# EAGLE design 13thISE.ver11 (EAGLE 9.6.2)
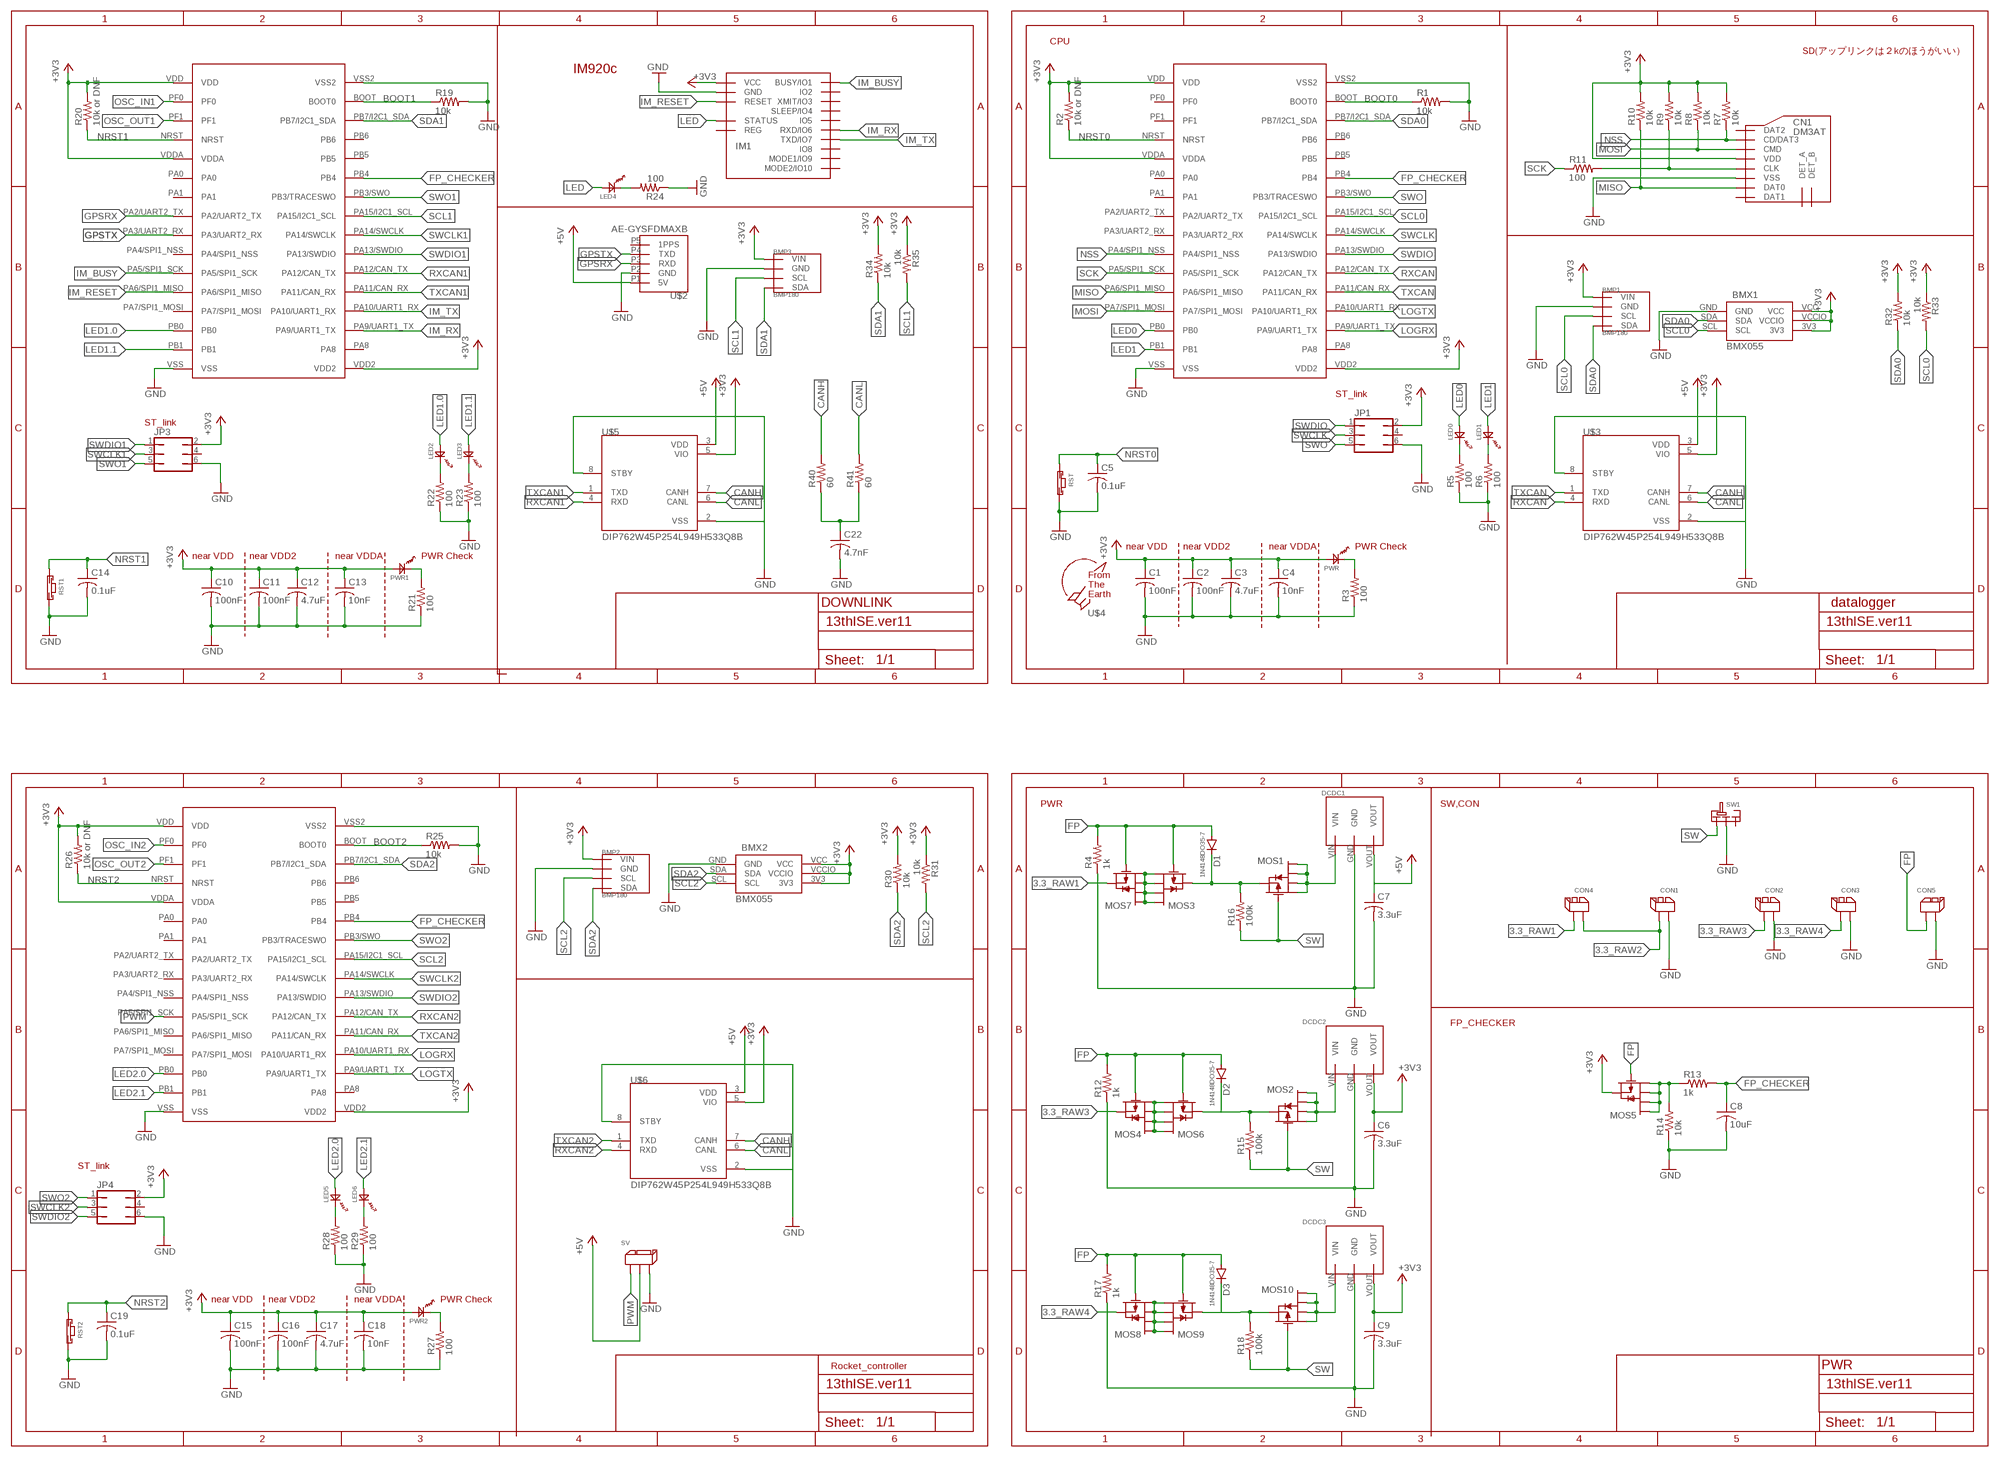
[diagram p0: schematic, sheet 1]

## Parts
BMP1  BMP180  [GY-68]
BMP2  BMP180  [GY-68]
BMP3  BMP180  [GY-68]
BMX1  BMX055  [BMX055]
BMX2  BMX055  [BMX055]
C1  100nF  C-USC1608  [C1608]
C2  100nF  C-USC1608  [C1608]
C3  4.7uF  C-USC1608  [C1608]
C4  10nF  C-USC1608  [C1608]
C5  0.1uF  C-USC1608  [C1608]
C6  3.3uF  C-USC0603  [C0603]
C7  3.3uF  C-USC0603  [C0603]
C8  10uF  C-USC0603  [C0603]
C9  3.3uF  C-USC0603  [C0603]
C10  100nF  C-USC1608  [C1608]
C11  100nF  C-USC1608  [C1608]
C12  4.7uF  C-USC1608  [C1608]
C13  10nF  C-USC1608  [C1608]
C14  0.1uF  C-USC1608  [C1608]
C15  100nF  C-USC1608  [C1608]
C16  100nF  C-USC1608  [C1608]
C17  4.7uF  C-USC1608  [C1608]
C18  10nF  C-USC1608  [C1608]
C19  0.1uF  C-USC1608  [C1608]
C22  4.7nF  C-USC0603  [C0603]
CN1  DM3AT  [DM3AT]
CON1  2PIN  [2PIN]
CON2  2PIN  [2PIN]
CON3  2PIN  [2PIN]
CON4  2PIN  [2PIN]
CON5  2PIN  [2PIN]
D1  1N4148DO35-7  [DO35-7]
D2  1N4148DO35-7  [DO35-7]
D3  1N4148DO35-7  [DO35-7]
DCDC1  5V1A_M78AR05-1  [5V1A_M78AR05-1]
DCDC2  3.3V1A_M78AR033-1  [3.3V1A_M78AR033-1]
DCDC3  3.3V1A_M78AR033-1  [3.3V1A_M78AR033-1]
IM1  IM920_IM920C  [IM920_IM920C]
JP1  JP3Q  [JP3Q]
JP3  JP3Q  [JP3Q]
JP4  JP3Q  [JP3Q]
LED0  OSXX1608C1A  [OSXX1608C1A]
LED1  OSXX1608C1A  [OSXX1608C1A]
LED2  OSXX1608C1A  [OSXX1608C1A]
LED3  OSXX1608C1A  [OSXX1608C1A]
LED4  OSXX1608C1A  [OSXX1608C1A]
LED5  OSXX1608C1A  [OSXX1608C1A]
LED6  OSXX1608C1A  [OSXX1608C1A]
MOS1  PCH_SSM6J808R  [SSM6J808R]
MOS2  PCH_SSM6J808R  [SSM6J808R]
MOS3  PCH_SSM6J808R  [SSM6J808R]
MOS4  PCH_SSM6J808R  [SSM6J808R]
MOS5  PCH_SSM6J808R  [SSM6J808R]
MOS6  PCH_SSM6J808R  [SSM6J808R]
MOS7  PCH_SSM6J808R  [SSM6J808R]
MOS8  PCH_SSM6J808R  [SSM6J808R]
MOS9  PCH_SSM6J808R  [SSM6J808R]
MOS10  PCH_SSM6J808R  [SSM6J808R]
PWR  OSXX1608C1A  [OSXX1608C1A]
PWR1  OSXX1608C1A  [OSXX1608C1A]
PWR2  OSXX1608C1A  [OSXX1608C1A]
R1  10k  R-US_R0603  [R0603]
R2  10k or DNF  R-US_R0603  [R0603]
R3  100  R-US_R0603  [R0603]
R4  1k  R-US_R0603  [R0603]
R5  100  R-US_R0603  [R0603]
R6  100  R-US_R0603  [R0603]
R7  10k  R-US_R0603  [R0603]
R8  10k  R-US_R0603  [R0603]
R9  10k  R-US_R0603  [R0603]
R10  10k  R-US_R0603  [R0603]
R11  100  R-US_R0603  [R0603]
R12  1k  R-US_R0603  [R0603]
R13  1k  R-US_R0603  [R0603]
R14  10k  R-US_R0603  [R0603]
R15  100k  R-US_R0603  [R0603]
R16  100k  R-US_R0603  [R0603]
R17  1k  R-US_R0603  [R0603]
R18  100k  R-US_R0603  [R0603]
R19  10k  R-US_R0603  [R0603]
R20  10k or DNF  R-US_R0603  [R0603]
R21  100  R-US_R0603  [R0603]
R22  100  R-US_R0603  [R0603]
R23  100  R-US_R0603  [R0603]
R24  100  R-US_R0603  [R0603]
R25  10k  R-US_R0603  [R0603]
R26  10k or DNF  R-US_R0603  [R0603]
R27  100  R-US_R0603  [R0603]
R28  100  R-US_R0603  [R0603]
R29  100  R-US_R0603  [R0603]
R30  10k  R-US_R0603  [R0603]
R31  10k  R-US_R0603  [R0603]
R32  10k  R-US_R0603  [R0603]
R33  10k  R-US_R0603  [R0603]
R34  10k  R-US_R0603  [R0603]
R35  10k  R-US_R0603  [R0603]
R40  60  R-US_R0603  [R0603]
R41  60  R-US_R0603  [R0603]
RST  TVAF06-A020B-R  [TVAF06-A020B-R]
RST1  TVAF06-A020B-R  [TVAF06-A020B-R]
RST2  TVAF06-A020B-R  [TVAF06-A020B-R]
STM0  STM32F303K8  [STM32F303K8]
STM1  STM32F303K8  [STM32F303K8]
SV  3PIN  [3PIN]
SW1  SRIDE_SWITCH  [SRIDE_SWITCH]
U$1  STM32F303K8  [STM32F303K8]
U$2  AE-GYSFDMAXB  [AE-GYSFDMAXB]
U$3  DIP762W45P254L949H533Q8B  [DIP762W45P254L949H533Q8B]
U$4  F.T.E.LOGO  [LOGO]
U$5  DIP762W45P254L949H533Q8B  [DIP762W45P254L949H533Q8B]
U$6  DIP762W45P254L949H533Q8B  [DIP762W45P254L949H533Q8B]

## Nets
3.3_RAW1: CON4.P$2 MOS7.4
3.3_RAW2: CON1.P$2 CON4.P$1
3.3_RAW3: CON2.P$2 MOS4.4
3.3_RAW4: CON3.P$2 MOS8.4
+3V3: BMP1.P1(VIN) BMP2.P1(VIN) BMP3.P1(VIN) BMX1.3V3 BMX1.VCC BMX1.VCCIO BMX2.3V3 BMX2.VCC BMX2.VCCIO C1.1 C2.1 C3.1 C4.1 C6.1 C9.1 C10.1 C11.1 C12.1 C13.1 C15.1 C16.1 C17.1 C18.1 CN1.VDD DCDC2.VOUT DCDC3.VOUT IM1.$P17(VCC) JP1.2 JP3.2 JP4.2 MOS5.4 PWR1.AN PWR2.AN PWR.AN R2.2 R7.2 R8.2 R9.2 R10.2 R20.2 R26.2 R30.2 R31.1 R32.2 R33.1 R34.2 R35.1 STM0.VDD STM0.VDD2 STM0.VDDA STM1.VDD STM1.VDD2 STM1.VDDA U$1.VDD U$1.VDD2 U$1.VDDA U$3.5(VIO) U$5.5(VIO) U$6.5(VIO)
+5V: C7.1 DCDC1.VOUT SV.P$2 U$2.P1(5V) U$3.3(VDD) U$5.3(VDD) U$6.3(VDD)
+5V1: DCDC1.VIN MOS1.1 MOS1.2 MOS1.5 MOS1.6
BOOT0: R1.1 STM0.BOOT(BOOT0)
BOOT1: R19.1 STM1.BOOT(BOOT0)
BOOT2: R25.1 U$1.BOOT(BOOT0)
CANH: R40.2 U$3.7(CANH) U$5.7(CANH) U$6.7(CANH)
CANL: R41.2 U$3.6(CANL) U$5.6(CANL) U$6.6(CANL)
FP: CON5.P$1 D1.A D2.A D3.A MOS3.3 MOS4.3 MOS5.3 MOS6.3 MOS7.3 MOS8.3 MOS9.3 R4.2 R12.2 R17.2
FP_CHECKER: C8.1 R13.2 STM0.PB4 STM1.PB4 U$1.PB4
GND: BMP1.P2(GND) BMP2.P2(GND) BMP3.P2(GND) BMX1.GND BMX2.GND C1.2 C2.2 C3.2 C4.2 C5.2 C6.2 C7.2 C8.2 C9.2 C10.2 C11.2 C12.2 C13.2 C14.2 C15.2 C16.2 C17.2 C18.2 C19.2 C22.2 CN1.VSS CON1.P$1 CON2.P$1 CON3.P$1 CON5.P$2 DCDC1.GND DCDC2.GND DCDC3.GND IM1.$P18(GND) JP1.6 JP3.6 JP4.6 R1.2 R3.1 R4.1 R5.1 R6.1 R12.1 R14.1 R17.1 R19.2 R21.1 R22.1 R23.1 R24.1 R25.2 R27.1 R28.1 R29.1 RST1.P$2 RST2.P$2 RST.P$2 STM0.VSS STM0.VSS2 STM1.VSS STM1.VSS2 SV.P$3 SW1.LR U$1.VSS U$1.VSS2 U$2.P2(GND) U$3.2(VSS) U$3.8(STBY) U$5.2(VSS) U$5.8(STBY) U$6.2(VSS) U$6.8(STBY)
GPSRX: STM1.PA2/UART2_TX U$2.P3(RXD)
GPSTX: STM1.PA3/UART2_RX U$2.P4(TXD)
IM_BUSY [im]: IM1.$P1(BUSY/IO1) STM1.PA5/SPI1_SCK
IM_RESET [im]: IM1.$P19(RESET) STM1.PA6/SPI1_MISO
IM_RX [im]: IM1.$P6(RXD/IO6) STM1.PA9/UART1_TX
IM_TX [im]: IM1.$P7(TXD/IO7) STM1.PA10/UART1_RX
LED [im]: IM1.$P15(STATUS) LED4.AN
LED0: LED0.AN STM0.PB0
LED1: LED1.AN STM0.PB1
LED1.0: LED2.AN STM1.PB0
LED1.1: LED3.AN STM1.PB1
LED2.0: LED5.AN U$1.PB0
LED2.1: LED6.AN U$1.PB1
LOGRX: STM0.PA9/UART1_TX U$1.PA10/UART1_RX
LOGTX: STM0.PA10/UART1_RX U$1.PA9/UART1_TX
MISO: CN1.DAT0 R10.1 STM0.PA6/SPI1_MISO
MOSI: CN1.CMD R8.1 STM0.PA7/SPI1_MOSI
N$1: PWR.CT R3.2
N$2: LED0.CT R5.2
N$3: D1.C MOS1.4 MOS3.4 R16.2
N$4: LED1.CT R6.2
N$5: D2.C MOS2.4 MOS6.4 R15.2
N$6: MOS4.1 MOS4.2 MOS4.5 MOS4.6 MOS6.1 MOS6.2 MOS6.5 MOS6.6
N$7: CN1.CLK R9.1 R11.2
N$8: DCDC2.VIN MOS2.1 MOS2.2 MOS2.5 MOS2.6
N$9: D3.C MOS9.4 MOS10.4 R18.2
N$10: MOS8.1 MOS8.2 MOS8.5 MOS8.6 MOS9.1 MOS9.2 MOS9.5 MOS9.6
N$11: PWR2.CT R27.2
N$12: MOS3.1 MOS3.2 MOS3.5 MOS3.6 MOS7.1 MOS7.2 MOS7.5 MOS7.6
N$13: DCDC3.VIN MOS10.1 MOS10.2 MOS10.5 MOS10.6
N$14: MOS5.1 MOS5.2 MOS5.5 MOS5.6 R13.1 R14.2
N$15: PWR1.CT R21.2
N$16: LED2.CT R22.2
N$17: LED3.CT R23.2
N$18: LED4.CT R24.2
N$19: LED5.CT R28.2
N$20: LED6.CT R29.2
N$22: C22.1 R40.1 R41.1
NRST0: C5.1 R2.1 RST.P$1 STM0.NRST
NRST1: C14.1 R20.1 RST1.P$1 STM1.NRST
NRST2: C19.1 R26.1 RST2.P$1 U$1.NRST
NSS: CN1.CD/DAT3 R7.1 STM0.PA4/SPI1_NSS
OSC_IN1: STM1.PF0
OSC_IN2: U$1.PF0
OSC_OUT1: STM1.PF1
OSC_OUT2: U$1.PF1
PWM: SV.P$1 U$1.PA5/SPI1_SCK
RXCAN: STM0.PA12/CAN_TX U$3.4(RXD)
RXCAN1: STM1.PA12/CAN_TX U$5.4(RXD)
RXCAN2: U$1.PA12/CAN_TX U$6.4(RXD)
SCK: R11.1 STM0.PA5/SPI1_SCK
SCL0: BMP1.P3(SCL) BMX1.SCL R33.2 STM0.PA15/I2C1_SCL
SCL1: BMP3.P3(SCL) R35.2 STM1.PA15/I2C1_SCL
SCL2: BMP2.P3(SCL) BMX2.SCL R31.2 U$1.PA15/I2C1_SCL
SDA0: BMP1.P4(SDA) BMX1.SDA R32.1 STM0.PB7/I2C1_SDA
SDA1: BMP3.P4(SDA) R34.1 STM1.PB7/I2C1_SDA
SDA2: BMP2.P4(SDA) BMX2.SDA R30.1 U$1.PB7/I2C1_SDA
SW: MOS1.3 MOS2.3 MOS10.3 R15.1 R16.1 R18.1 SW1.L
SWCLK: JP1.3 STM0.PA14/SWCLK
SWCLK1: JP3.3 STM1.PA14/SWCLK
SWCLK2: JP4.3 U$1.PA14/SWCLK
SWDIO: JP1.1 STM0.PA13/SWDIO
SWDIO1: JP3.1 STM1.PA13/SWDIO
SWDIO2: JP4.5 U$1.PA13/SWDIO
SWO: JP1.5 STM0.PB3/SWO(PB3/TRACESWO)
SWO1: JP3.5 STM1.PB3/SWO(PB3/TRACESWO)
SWO2: JP4.1 U$1.PB3/SWO(PB3/TRACESWO)
TXCAN: STM0.PA11/CAN_RX U$3.1(TXD)
TXCAN1: STM1.PA11/CAN_RX U$5.1(TXD)
TXCAN2: U$1.PA11/CAN_RX U$6.1(TXD)
Unconnected: CN1.DAT1 CN1.DAT2 CN1.DET_A CN1.DET_B IM1.$P2(IO2) IM1.$P3(XMIT/IO3) IM1.$P4(SLEEP/IO4) IM1.$P5(IO5) IM1.$P8(IO8) IM1.$P9(MODE1/IO9) IM1.$P10(MODE2/IO10) IM1.$P16(REG) JP1.4 JP3.4 JP4.4 STM0.PA0 STM0.PA1 STM0.PA2/UART2_TX STM0.PA3/UART2_RX STM0.PA8 STM0.PB5 STM0.PB6 STM0.PF0 STM0.PF1 STM1.PA0 STM1.PA1 STM1.PA4/SPI1_NSS STM1.PA7/SPI1_MOSI STM1.PA8 STM1.PB5 STM1.PB6 SW1.R U$1.PA0 U$1.PA1 U$1.PA2/UART2_TX U$1.PA3/UART2_RX U$1.PA4/SPI1_NSS U$1.PA6/SPI1_MISO U$1.PA7/SPI1_MOSI U$1.PA8 U$1.PB5 U$1.PB6 U$2.P5(1PPS)

## Notes on the sheet
- CPU
- SD(アップリンクは２kのほうがいい）
- IM920c
- ST_link
- ST_link
- near VDD | near VDD2 | near VDDA | PWR Check
- near VDD | near VDD2 | near VDDA | PWR Check
- DOWNLINK | datalogger
- PWR | SW,CON
- FP_CHECKER
- ST_link
- near VDD | near VDD2 | near VDDA | PWR Check
- Rocket_controller | PWR

## Library data of the parts
BMP1-BMP3 = BMP180:BMP180
BMX1 BMX2 = BMX055:BMX055
C1-C19 C22 = rcl:C-US: CAPACITOR, American symbol; SPICEPREFIX: C
CN1 = microSD:DM3AT
CON1-CON5 = XR Connector:2PIN
D1-D3 = diode:1N4148: DIODE high speed (Philips)
DCDC1 = DC-DC:5V1A_M78AR05-1
DCDC2 DCDC3 = DC-DC:3.3V1A_M78AR033-1
IM1 = CANSAT12th:IM920_IM920C
JP1 JP3 JP4 = jumper:JP3Q: JUMPER
LED0 LED1-LED6 PWR PWR1 PWR2 = Chip LED:OSXX1608C1A
MOS1-MOS10 = Chip MOSFET:PCH_SSM6J808R
R1-R35 R40 R41 = rcl:R-US_: RESISTOR, American symbol; SPICEPREFIX: R
RST RST1 RST2 = Tact switch:TVAF06-A020B-R
STM0 STM1 U$1 = STM32F303K8:STM32F303K8
SV = XR Connector:3PIN
SW1 = Sride Switch:SRIDE_SWITCH
U$2 = AE-GYSFDMAXB:AE-GYSFDMAXB
U$3 U$5 U$6 = MCP2562-E_P:DIP762W45P254L949H533Q8B
U$4 = logo:F.T.E.LOGO

## Net classes
0 default: width 0.406 mm

## Board
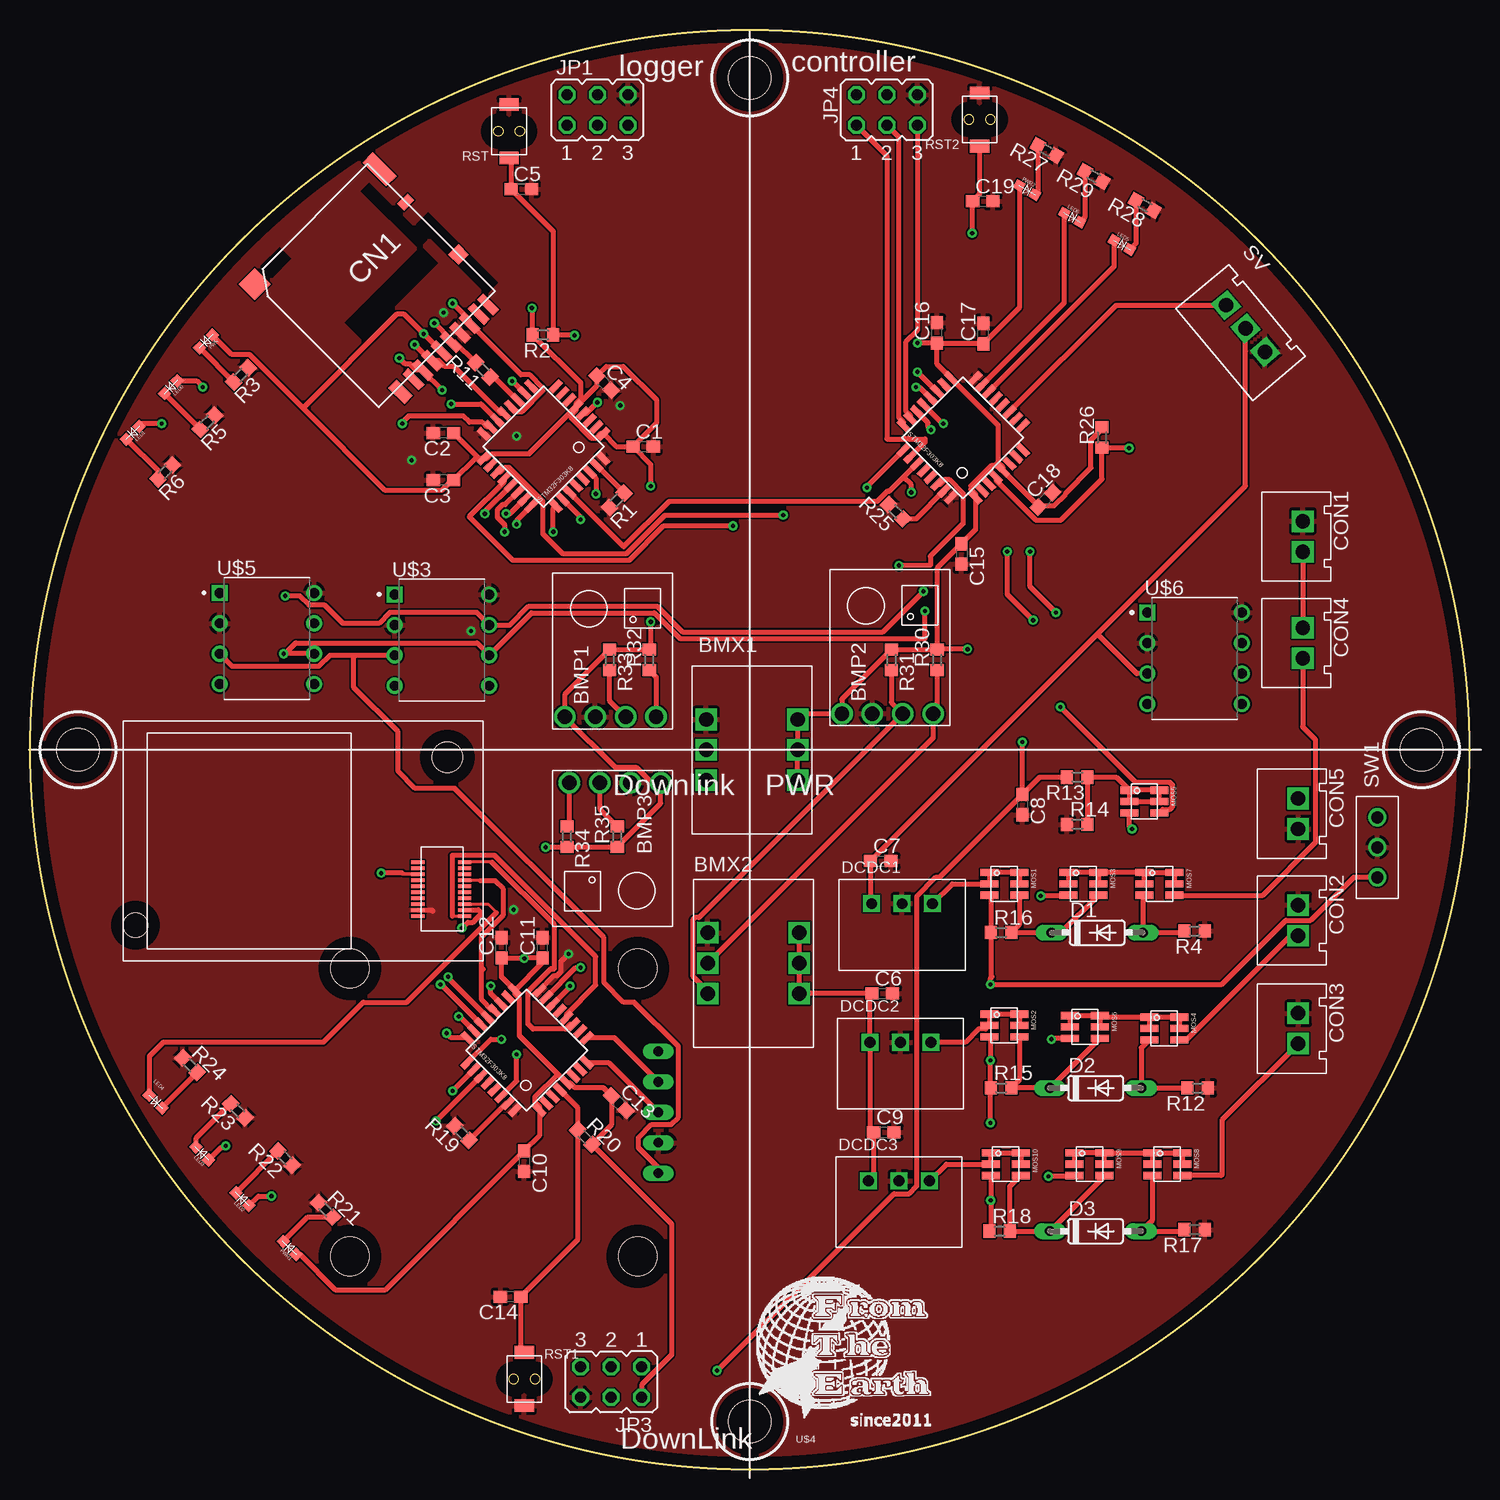
[diagram p1: board, top side]
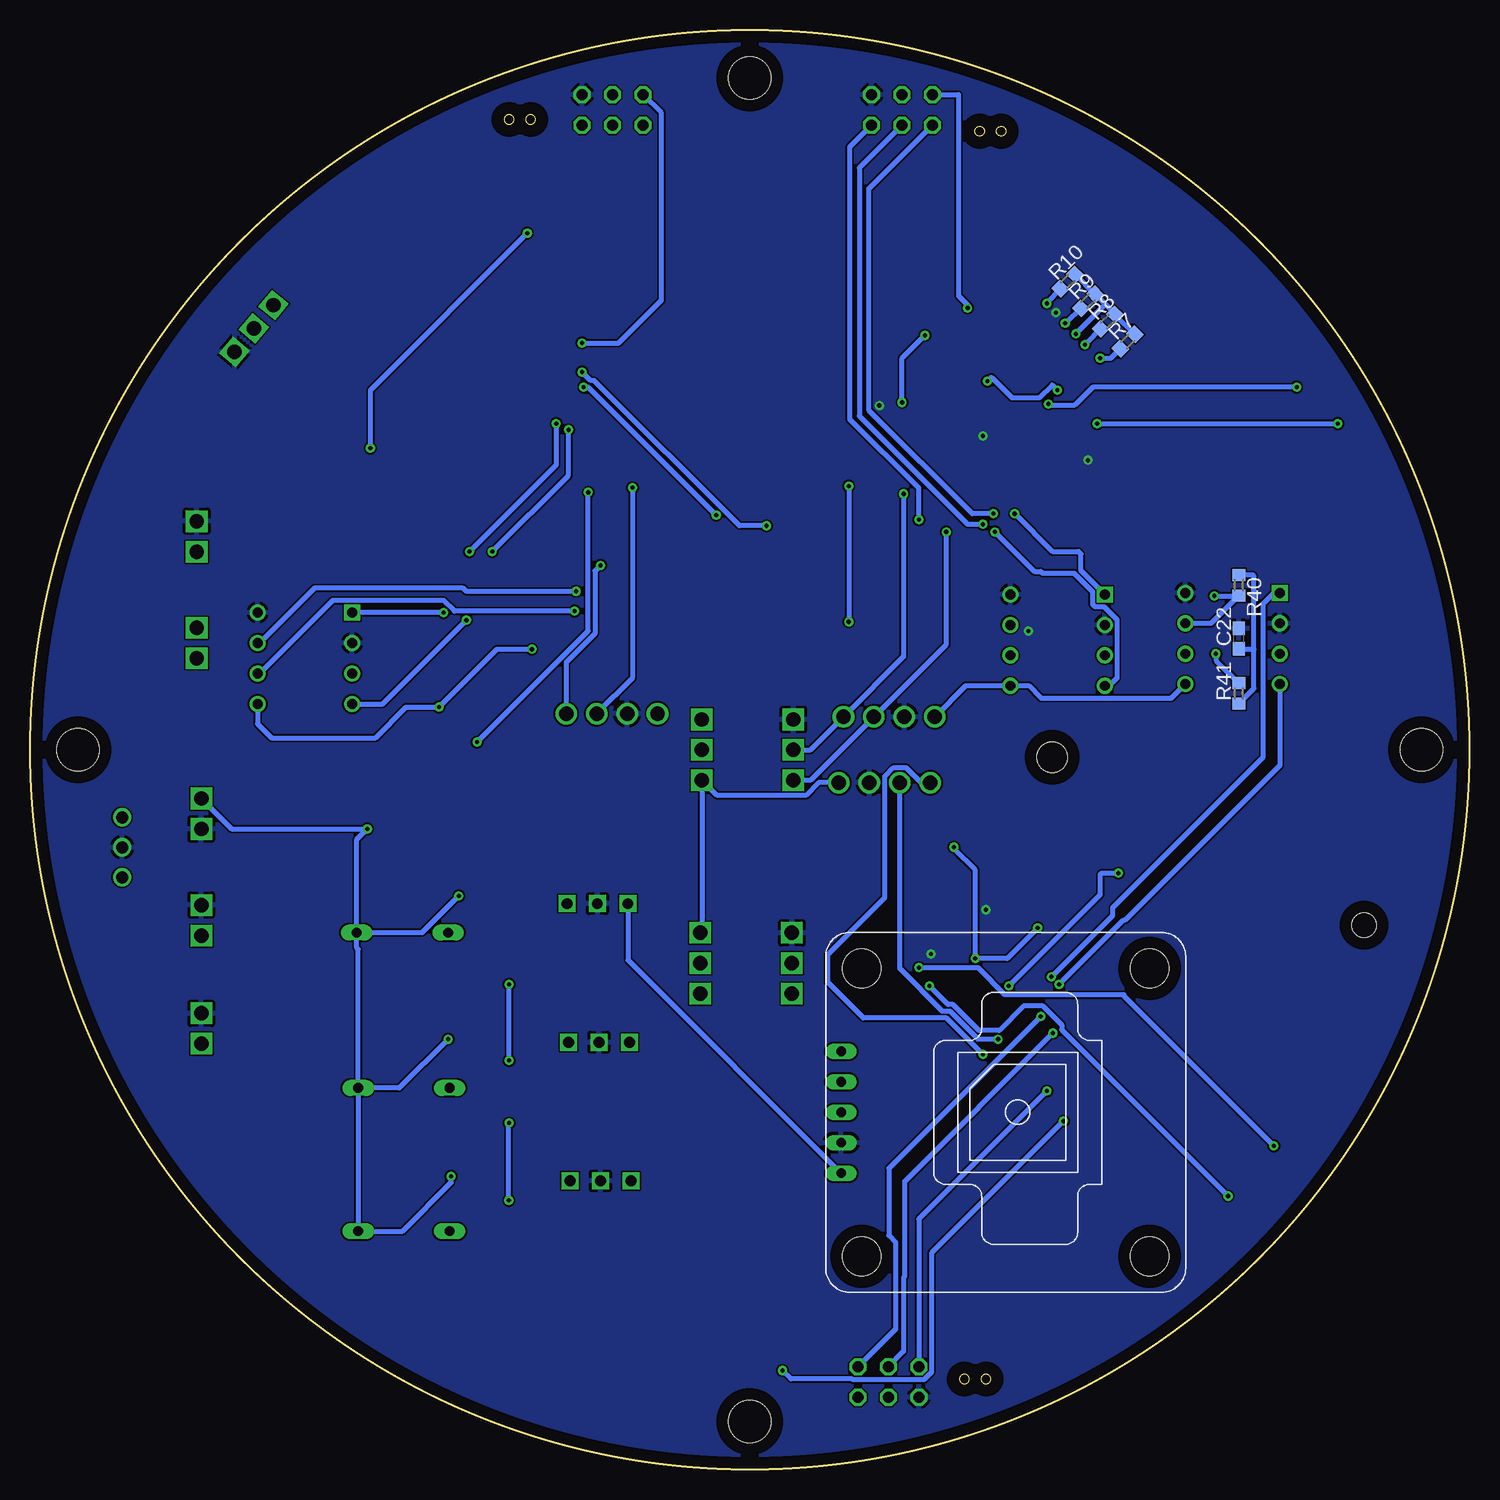
[diagram p2: board, bottom side, seen from below]

Size 120 x 120 mm. Coordinates in mm from the lower left corner, seen from the top.
Outline: circle at 60,60 radius 60
Copper layers (1*16): Top 0.035mm / dielectric 1.5mm / Bottom 0.035mm
Design rules "default": minimum track width 6mil, minimum drill 0.35mm, track to track 6mil, track to pad 6mil, pad to pad 6mil, via to via 6mil, smd to smd 6mil, copper to edge 40mil, drill to drill 6mil, minimum pad ring 10mil, minimum via ring 8mil, stop-mask expansion 4mil, vias tented up to drill 0mil, thermal gap 10mil
Holes 3.5 mm at 4,60 60,4 116,60 60,116

### Footprints (pad centres in the part's own frame; a part is rotated, then mirrored left to right if it is on the bottom)
GY-68 = drill 1.2: P1 -5,4; P2 -5,1.46; P3 -5,-1.08; P4 -5,-3.62
BMX055 = drill 1.2 pad 1.5 square: 3V3 8.81,-9.53; GND 1.19,-4.46; SCL 1.19,-9.53; SDA 1.19,-7; VCC 8.81,-4.46; VCCIO 8.81,-7
C1608 = smd 1.1 x 1: 1 -0.85,0; 2 0.85,0
C0603 = smd 1.1 x 1: 1 -0.85,0; 2 0.85,0
DM3AT = smd 0.7 x 1.9: CD/DAT3 2.2,6.4; CLK -1.1,6.4; CMD 1.1,6.4; DAT0 -3.3,6.4; DAT1 -4.4,6.4; DAT2 3.3,6.4; DET_B -5.5,6.4; VDD 0,6.4; VSS -2.2,6.4 | smd 1.2 x 0.8: DET_A -6.7,-4.5 | smd 1 x 1.9: P$9 4.8,6.381 | smd 1.2 x 1.2: P$11 -6.7,1.7 | smd 1.2 x 2.8: P$13 -7.081,-7.973 | smd 1.9 x 1.9: P$14 7.054,-8.562
2PIN = drill 1.2 square: P$1 -1.27,0; P$2 1.27,0
DO35-7 = drill 0.813 long: A 3.81,0; C -3.81,0
5V1A_M78AR05-1 = drill 0.9 pad 1.27 square: GND 0,0; VIN 2.54,0; VOUT -2.54,0
3.3V1A_M78AR033-1 = drill 0.9 pad 1.27 square: GND 0,0; VIN 2.54,0; VOUT -2.54,0
IM920_IM920C = smd 0.3 x 1.1: $P1 -1.75,-13.45; $P2 -1.75,-9.55; $P3 -2.25,-13.45; $P4 -2.25,-9.55; $P5 -2.75,-13.45; $P6 -2.75,-9.55; $P7 -3.25,-13.45; $P8 -3.25,-9.55; $P9 -3.75,-13.45; $P10 -3.75,-9.55; $P11 -4.25,-13.45; $P12 -4.25,-9.55; $P13 -4.75,-13.45; $P14 -4.75,-9.55; $P15 -5.25,-13.45; $P16 -5.25,-9.55; $P17 -5.75,-13.45; $P18 -5.75,-9.55; $P19 -6.25,-13.45; $P20 -6.25,-9.55 | hole 2.5: 7,-12 | hole 2: -7,14
JP3Q = drill 0.914 octagon: 1 -2.54,-1.27; 2 -2.54,1.27; 3 0,-1.27; 4 0,1.27; 5 2.54,-1.27; 6 2.54,1.27
OSXX1608C1A = smd 0.8 x 0.8: AN -0.75,0; CT 0.75,0
SSM6J808R = smd 0.6 x 1.5: 1 -0.95,-1.25; 2 0,-1.25; 3 0.95,-1.25; 4 0.95,1.25; 5 0,1.25; 6 -0.95,1.25
R0603 = smd 1 x 1.1: 1 -0.85,0; 2 0.85,0
TVAF06-A020B-R = smd 1.6 x 1.05: P$1 0,2.225; P$2 0,-2.225
STM32F303K8 = smd 0.5 x 1.2: BOOT 1.6,8.5; PA3/UART2_RX 0.8,0; PA4/SPI1_NSS 1.6,0; PA5/SPI1_SCK 2.4,0; PA6/SPI1_MISO 3.2,0; PA7/SPI1_MOSI 4,0; PA15/I2C1_SCL 6.4,8.5; PB0 4.8,0; PB1 5.6,0; PB3/SWO 5.6,8.5; PB4 4.8,8.5; PB5 4,8.5; PB6 3.2,8.5; PB7/I2C1_SDA 2.4,8.5; VSS 0.8,8.5; VSS2 6.4,0 | smd 1.2 x 0.5: NRST -0.65,4.65; PA0 -0.65,3.05; PA1 -0.65,2.25; PA2/UART2_TX -0.65,1.45; PA8 7.85,2.25; PA9/UART1_TX 7.85,3.05; PA10/UART1_RX 7.85,3.85; PA11/CAN_RX 7.85,4.65; PA12/CAN_TX 7.85,5.45; PA13/SWDIO 7.85,6.25; PA14/SWCLK 7.85,7.05; PF0 -0.65,6.25; PF1 -0.65,5.45; VDD -0.65,7.05; VDD2 7.85,1.45; VDDA -0.65,3.85
3PIN = drill 1.2 square: P$1 2.54,-2.54; P$2 5.08,-2.54; P$3 7.62,-2.54
SRIDE_SWITCH = drill 1: L -2.5,0; LR 0,0; R 2.5,0
AE-GYSFDMAXB = drill 0.8 long: P1 13.716,5.08; P2 13.716,2.54; P3 13.716,0; P4 13.716,-2.54; P5 13.716,-5.08 | hole 3.2: -12,12; 12,12; 12,-12; -12,-12
DIP762W45P254L949H533Q8B = drill 0.83 square: 1 -3.937,3.81 | drill 0.83: 2 -3.937,1.27; 3 -3.937,-1.27; 4 -3.937,-3.81; 5 3.937,-3.81; 6 3.937,-1.27; 7 3.937,1.27; 8 3.937,3.81

### Placement (x,y rotation side)
BMP1  48.57,67.75 90 top
BMP2  71.68,68 90 top
BMP3  48.57,52.25 270 top
BMX1  55.17,66.98 0 top
BMX2  55.3,49.2 0 top
C1  51.11,85.27 0 top
C2  34.47,86.42 180 top
C3  34.47,82.48 180 top
C4  47.85,90.57 315 top
C5  40.95,106.74 0 top
C6  71.05,39.68 0 top
C7  70.92,50.73 0 top
C8  82.73,55.43 270 top
C9  71.18,28.12 0 top
C10  41.2,25.71 270 top
C11  42.73,43.49 90 top
C12  39.3,43.49 90 top
C13  49.08,30.54 315 top
C14  40.06,14.41 180 top
C15  77.65,76.32 270 top
C16  75.62,94.74 90 top
C17  79.47,94.69 90 top
C18  84.65,80.84 45 top
C19  79.43,105.72 0 top
C22  19.23,69.27 90 bottom
CN1  29.77,97.74 225 top
CON1  106.1,77.78 270 top
CON2  105.72,45.78 270 top
CON3  105.72,36.76 270 top
CON4  106.1,68.89 270 top
CON5  105.72,54.67 270 top
D1  88.96,44.76 0 top
D2  88.83,31.81 0 top
D3  88.83,19.87 0 top
DCDC1  72.7,47.17 0 top
DCDC2  72.57,35.62 0 top
DCDC3  72.45,24.06 0 top
IM1  22.79,52.38 90 top
JP1  47.3,113.34 0 top
JP3  48.44,7.3 180 top
JP4  71.43,113.34 0 top
LED0  11.74,90.23 225 top
LED1  8.56,86.42 225 top
LED2  17.71,22.53 135 top
LED3  14.35,26.34 135 top
LED4  10.47,30.66 315 top
LED5  91.02,102.08 330 top
LED6  86.88,104.37 330 top
MOS1  81.21,48.82 270 top
MOS2  81.21,37.01 270 top
MOS3  87.81,48.82 270 top
MOS4  94.54,36.76 270 top
MOS5  92.89,55.68 270 top
MOS6  87.94,36.89 270 top
MOS7  94.16,48.82 270 top
MOS8  94.8,25.46 270 top
MOS9  88.32,25.46 270 top
MOS10  81.34,25.46 270 top
PWR  14.66,94.04 225 top
PWR1  21.65,18.47 135 top
PWR2  83.11,106.65 330 top
R1  48.91,80.79 225 top
R2  42.77,94.58 180 top
R3  17.58,91.24 225 top
R4  97.08,44.89 180 top
R5  14.79,87.31 225 top
R6  11.27,83.15 225 top
R7  28.5,94.04 45 bottom
R8  30.16,95.69 45 bottom
R9  31.81,97.39 45 bottom
R10  33.49,99.03 45 bottom
R11  37.75,91.66 135 top
R12  97.34,31.81 180 top
R13  87.31,57.71 180 top
R14  87.31,53.78 0 top
R15  80.95,31.81 0 top
R16  80.95,44.76 0 top
R17  97.08,19.99 180 top
R18  80.83,19.87 0 top
R19  36,28.05 135 top
R20  46.25,27.7 315 top
R21  24.64,21.65 315 top
R22  21.27,25.96 135 top
R23  17.33,29.9 135 top
R24  13.34,33.71 315 top
R25  72.17,79.85 135 top
R26  89.36,86.03 90 top
R27  84.76,109.95 150 top
R28  92.93,105.38 150 top
R29  88.66,107.79 150 top
R30  75.62,67.49 90 top
R31  71.81,67.49 270 top
R32  51.62,67.49 90 top
R33  48.32,67.49 270 top
R34  44.76,52.76 270 top
R35  48.95,52.76 90 top
R40  19.23,73.72 270 bottom
R41  19.23,64.7 90 bottom
RST  39.93,111.56 180 top
RST1  41.2,7.55 0 top
RST2  79.16,112.54 180 top
STM0  42.35,90.86 225 top
STM1  46.99,35.41 135 top
SV  100,100.64 310 top
SW1  112.32,51.87 90 top
U$1  83.35,86.47 135 top
U$2  38.66,29.77 180 bottom
U$3  34.35,69.14 0 top
U$4  60,2.22 0 top
U$5  19.74,69.27 0 top
U$6  97.08,67.62 0 top

### Tracks (layer width: path | path; a pad name or v marks a point on that pad's centre or on a via)
3.3_RAW1
  Top 0.406: CON4.P$2 106.1,61.91 107.16,60.84 107.16,52.26 102.78,47.87 MOS7.4
3.3_RAW2
  Top 0.406: CON1.P$2 CON4.P$1
3.3_RAW3
  Top 0.406: CON2.P$2 105.09,44.51 96.4,35.81 MOS4.4
3.3_RAW4
  Top 0.406: CON3.P$2 99.37,29.14 99.37,24.57 99.31,24.51 MOS8.4
+3V3  (via drill 0.35)
  Top 0.406: C16.1 79.41,93.89 C17.1 82.46,96.84 PWR2.AN | C16.1 73.98,93.89 v73.97,93.91 | C16.1 75.62,92.15 U$1.VDD2 80.7,87.07 80.7,83.95 | 80.7,83.95 81.09,83.56 U$1.VDDA 84.05,80.33 C18.1 84.15,80.34 85.36,80.34 86.34,81.33 86.34,81.39 88.46,83.5 88.46,85.83 89.36,86.74 R26.2 | 80.7,83.95 80.42,83.68 80.13,83.68 78.43,81.99 78.43,81.69 78.82,81.3 U$1.VDD 78.82,78.34 C15.1 75.62,75.14 R30.2 | R30.2 R31.1 67.68,64.22 BMP2.P1 64.46,63 BMX1.VCC BMX1.VCCIO BMX1.3V3 | BMX2.3V3 C6.1 70.03,39.51 DCDC2.VOUT 70.03,28.42 C9.1 70.33,24.48 DCDC3.VOUT | BMX2.3V3 | BMX2.VCC BMX2.VCCIO BMX2.3V3 | CN1.VDD 34.28,93.22 v32.82,94.67 31.2,96.29 30.56,96.29 22.75,88.48 | STM0.VDDA 45.53,88.87 45.92,89.26 45.92,90.58 R2.2 41.84,94.66 v41.84,96.83 | C1.1 52.21,87.22 52.21,89.19 49.45,91.96 48.03,91.96 C4.1 47.24,90.31 STM0.VDDA | C1.1 48.85,85.27 STM0.VDD 47.52,86.34 47.13,85.94 46.83,85.94 45.14,87.64 45.14,87.93 45.53,88.32 STM0.VDDA | STM0.VDD2 37.13,84.28 C3.1 35.18,82.48 34.32,81.62 29.61,81.62 22.75,88.48 | STM0.VDD2 37.45,84.28 C2.1 | PWR.AN 16.82,92.94 18.3,92.94 22.75,88.48 | STM1.VDD2 39.3,41.06 C12.1 39.34,42.6 v41.2,42.6 41.24,42.64 C11.1 42.73,42.25 STM1.VDD2 | STM1.VDD2 40.42,39.66 40.81,39.27 40.81,36.16 44.01,32.96 | 44.01,32.96 STM1.VDDA 45.01,32.23 45.4,31.84 47.77,31.84 C13.1 48.48,28.73 R20.2 53.48,20.47 53.48,9.56 50.98,7.06 JP3.2 | 44.01,32.96 42.08,31.03 42.08,30.64 42.47,30.25 STM1.VDD 42.47,27.82 C10.1 29.6,14.95 25.5,14.95 22.51,17.94 PWR1.AN | MOS5.4 94.44,55.03 95.04,55.03 95.25,55.23 95.25,57.08 95.04,57.29 92.18,57.29 v85.91,63.56 | v78.16,68.38 75.66,68.38 R30.2
  Top 0.406: v42.98,51.87 43.02,51.91 R34.2 R35.1 52.57,55.53 BMP3.P1 51.81,57.25 50.55,58.51 48.81,58.51 BMP1.P1 44.57,64.6 R33.1 R32.2 51.74,68.47 v51.74,70.67 | STM0.VDD2 38.1,84.28 38.49,84.68 41.61,84.68 STM0.VDDA | C1.1 51.74,83.79 v51.74,81.97 | IM1.$P17 37.36,46.63 37.39,46.66 37.58,46.48 37.58,46.3 37.14,45.86 37.14,45.83 36.94,45.62 36.48,45.62 v36,45.14
  Bottom 0.406: v73.97,93.91 70.92,93.91 67.37,97.47 67.37,113.09 JP4.2 | BMX2.VCC 63.98,44.87 BMX1.3V3 62.73,56.2 55.32,56.2 54.26,57.25 BMP3.P1 | R10.2 31.26,97.99 R9.2 30.35,97.14 | 30.35,97.14 29.55,96.34 R8.2 R7.2 | 30.35,97.14 v32.82,94.67 | v36,45.14 38.54,42.6 v41.2,42.6 41.2,49.97 42.98,51.74 v42.98,51.87 | v78.16,68.38 81.08,68.38 v85.91,63.56 88.65,63.56 91.21,61 99.86,61 101.02,62.16 U$6.5 | JP1.2 42.6,114.61 42.6,97.85 41.84,97.08 v41.84,96.83 | v51.74,81.97 v51.74,70.67 | BMP1.P1 41.98,65.33 U$3.5 36.75,65.33 35.72,64.3 24.84,64.3 U$5.5
+5V
  Top 0.406: DCDC1.VOUT 70.07,47.26 C7.1 88.98,69.63 | SV.P$2 101.33,93.19 101.32,93.19 101.32,81.98 88.98,69.63 | 27.11,67.87 25,67.87 24.1,66.98 16.83,66.98 U$5.3 | U$2.P1 52.38,25.15 50.72,26.82 50.72,27.65 51.83,28.76 53.45,28.76 54.04,29.36 54.04,35.27 50.36,38.95 49.5,38.95 47.84,40.61 47.84,44.34 35.4,56.78 32.11,56.78 30.67,58.23 30.67,61.52 26.98,65.21 26.98,67.75 27.11,67.87 | 88.98,69.63 92.26,66.35 U$6.3 | U$3.3 27.11,67.87
  Bottom 0.406: DCDC1.VOUT 70.16,42.47 U$2.P1
+5V1
  Top 0.406: MOS1.5 MOS1.6 MOS1.1 MOS1.2 76.89,48.82 DCDC1.VIN
BOOT0
  Top 0.406: STM0.BOOT 49.52,81.43 R1.1
BOOT1
  Top 0.406: R19.1 39.69,30.54 STM1.BOOT
BOOT2
  Top 0.406: U$1.BOOT 73.86,79.25 R25.1
CANH  (via drill 0.35)
  Top 0.406: v21.27,72.83 22.48,72.83 23.25,72.06 24.58,72.06 26.09,70.54 29.09,70.54 29.98,71.44 37.26,71.44 U$3.7 40.03,70.41 41.58,71.96 52.28,71.96 54.41,69.83 71.1,69.83 v74.48,73.21
  Bottom 0.406: v21.27,72.83 19.27,72.83 R40.2 21.56,70.54 U$5.7 | U$6.7 100.85,68.89 96.28,73.46 83.88,73.46 83.62,73.21 v74.48,73.21
CANL  (via drill 0.35)
  Top 0.406: 21.27,68 22.16,68.9 37.26,68.9 U$3.6 41.81,71.4 52.05,71.4 54.18,69.27 74.61,69.27 v74.61,71.56 | 21.27,68 v21.14,68 | U$5.6 21.27,68
  Bottom 0.406: v21.14,68 21.14,67.45 R41.2 | U$6.6 100.85,66.35 94.75,72.45 85.51,72.45 84.62,71.56 v74.61,71.56
FP  (via drill 0.35)
  Top 0.406: MOS7.3 92.77,47.73 D1.A 96.11,44.76 R4.2 | MOS8.3 93.55,20.78 D3.A 96.11,19.87 R17.2 | MOS9.3 87,24.44 v84.89,24.44 | MOS4.3 92.64,35.15 D2.A R12.2 | MOS6.3 85.21,35.94 v85.15,35.87 | v84.26,47.81 84.32,47.87 MOS3.3 | v91.88,53.4 91.64,53.63 MOS5.3
  Bottom 0.406: v84.89,24.44 84.89,23.93 88.96,19.87 D3.A D2.A | D2.A 89.21,31.81 v85.15,35.87 | D1.A 92.77,43.49 92.64,43.36 D2.A | D1.A 87.31,44.76 v84.26,47.81 | D1.A 92.77,52.51 v91.88,53.4 103.18,53.4 CON5.P$1
FP_CHECKER  (via drill 0.35)
  Top 0.406: C8.1 84.17,57.71 R13.2 | U$1.PB4 72.83,82.73 | 72.83,82.73 71.64,81.55 71.46,81.55 70.61,80.7 53.28,80.7 49.5,76.92 STM0.PB4 | C8.1 v82.73,60.63 | v73.46,81.46 73.46,82.1 72.83,82.73 | STM1.PB4 v33.84,29.05 | C8.1 75.84,49.38 75.54,49.38 73.93,47.77 73.93,23.63 73.3,23 72.02,23 v57.27,8.25
  Bottom 0.406: v82.73,60.63 73.46,69.91 v73.46,81.46 | v33.84,29.05 44.84,18.05 44.84,8.12 45.46,7.5 51.42,7.5 51.48,7.55 56.57,7.55 v57.27,8.25
GND  (via drill 0.35)
  Top 0.406: STM1.VSS2 43.7,41.18 43.94,41.18 44.27,41.5 44.27,42.36 v44.89,42.98 | IM1.$P18 33.49,46.63 33.58,46.54
  other vias: 40.31,46.66 49.2,88.7 31.81,84.13 40.57,86.16 36.76,69.91 34.47,96.45
  pour Top: -3.75,68.38 -3.75,33.46 32.31,-2.61 94.29,-2.61 124.52,27.62 124.52,85.4 88.45,121.47 30.79,121.47 -3.37,87.31 -3.37,68.76
  pour Bottom: -3.75,87.18 -3.75,33.71 32.44,-2.48 93.66,-2.48 124.39,28.25 124.39,85.4 88.32,121.47 30.54,121.47
GPSRX
  Top 0.406: STM1.PA2/UART2_TX 48.22,33.93 U$2.P3
GPSTX
  Top 0.406: U$2.P4 48.71,35.98 STM1.PA3/UART2_RX
IM_BUSY
  Top 0.254: 38.49,50.64 IM1.$P1
  Top 0.406: STM1.PA5/SPI1_SCK 45.02,37.11 44.63,36.72 41.92,36.72 41.51,37.13 41.51,39.84 43.41,41.73 43.71,41.73 43.71,45.42 38.49,50.64
IM_RESET
  Top 0.254: IM1.$P19 35.21,46.12
  Top 0.406: 35.21,46.12 35.21,51.19 38.73,51.19 47.15,42.77 47.15,40.38 44.73,37.95 STM1.PA6/SPI1_MISO
IM_RX  (via drill 0.35)
  Top 0.305: IM1.$P6 31.13,49.63 31.04,49.71
  Top 0.406: STM1.PA9/UART1_TX 38.41,39.69 v38.41,40.31 | 31.04,49.71 v29.27,49.71
  Bottom 0.406: v29.27,49.71 30.66,49.71 30.79,49.59 30.79,47.94 v38.41,40.31
IM_TX
  Top 0.254: IM1.$P7 37.47,49.13 37.52,49.08
  Top 0.406: STM1.PA10/UART1_RX 38.58,38.24 37.65,39.17 37.65,41.59 | 37.65,41.59 37.77,41.71 | 37.65,41.59 37.65,44.4 39.48,46.23 39.48,48.39 38.79,49.08 37.52,49.08
LED
  Top 0.254: IM1.$P15 38.2,47.13 38.89,46.44
  Top 0.406: LED4.AN 9.94,34.45 11.1,35.62 24.44,35.62 27.78,38.95 31.41,38.95 38.89,46.44
LED0  (via drill 0.35)
  Top 0.406: LED0.AN 13.88,90.76 v14.41,90.23 | v35.11,88.83 37.59,88.83 STM0.PB0
  Bottom 0.406: v14.41,90.23 31.4,90.23 32.9,88.73 35.01,88.73 v35.11,88.83
LED1  (via drill 0.35)
  Top 0.406: STM0.PB1 38.11,86.9 37.72,87.29 36.64,87.29 36.12,87.81 31.55,87.81 31.04,87.31 v31.04,87.18 | v10.98,87.18 9.33,87.18 LED1.AN
  Bottom 0.406: v31.04,87.18 v10.98,87.18
LED1.0  (via drill 0.35)
  Top 0.406: v45.01,40.31 45.01,40.22 STM1.PB0 | LED2.AN 19.02,22.79 v20.12,22.79
  Bottom 0.406: v20.12,22.79 33.99,36.66 33.99,37.06 35.57,38.64 37.17,38.64 39.2,36.6 40.89,36.6 43.05,38.76 43.46,38.76 v45.01,40.31
LED1.1  (via drill 0.35)
  Top 0.406: STM1.PB1 45.5,41.84 v45.9,41.84 | LED3.AN 15.92,26.85 16.19,26.85 v16.31,26.98
  Bottom 0.406: v45.9,41.84 40.97,41.84 38.71,39.58 28.79,39.58 28.79,39.45 v16.31,26.98
LED2.0
  Top 0.406: LED5.AN 90.37,100.28 U$1.PB0
LED2.1
  Top 0.406: U$1.PB1 86.23,97.27 LED6.AN
LOGRX  (via drill 0.35)
  Top 0.406: v62.79,79.56 52.93,79.56 49.73,76.36 44.38,76.36 42.74,78 42.74,80.72 39.91,83.54 39.62,83.54 39.23,83.15 STM0.PA9/UART1_TX | v73.84,90.23 74.15,90.23 U$1.PA10/UART1_RX
  Bottom 0.406: v62.79,79.56 73.46,90.23 v73.84,90.23
LOGTX  (via drill 0.35)
  Top 0.406: STM0.PA10/UART1_RX 39.52,82.31 36.62,79.42 40.24,75.8 49.96,75.8 52.83,78.67 v58.6,78.67 | v73.97,91.5 75.6,89.86 U$1.PA9/UART1_TX
  Bottom 0.406: v73.97,91.5 73.26,90.78 72.98,90.78 60.87,78.67 v58.6,78.67
MISO  (via drill 0.35)
  Top 0.406: v35.23,97.21 36.63,95.81 CN1.DAT0 40.93,91.25 41.68,91.25 42.74,90.19 42.74,89.9 41.05,88.21 40.54,88.21 40.15,88.6 STM0.PA6/SPI1_MISO
  Bottom 0.406: R10.1 35.23,97.28 v35.23,97.21
MOSI  (via drill 0.35)
  Top 0.406: v32.06,93.78 33.4,92.44 CN1.CMD 34.08,92.44 34.58,91.94 35.36,91.94 39.27,88.03 STM0.PA7/SPI1_MOSI
  Bottom 0.406: R8.1 31.93,93.91 | 31.93,93.91 | 31.93,93.91 v32.06,93.78
N$1
  Top 0.406: PWR.CT 16.98,90.66 R3.2
N$2
  Top 0.406: LED0.CT 14.19,86.72 R5.2
N$3
  Top 0.406: MOS3.4 85.95,44.76 D1.C R16.2 82.46,45.41 MOS1.4
N$4
  Top 0.406: LED1.CT 10.67,83.25 R6.2
N$5
  Top 0.406: MOS2.4 82.46,32.46 81.83,31.83 | 81.83,31.83 R15.2 | 81.83,31.83 81.84,31.81 D2.C 85.06,31.81 MOS6.4
N$6
  Top 0.406: MOS6.6 MOS6.5 | MOS6.6 89.32,37.71 MOS4.1 | MOS6.6 MOS6.1 MOS6.2 | MOS4.1 MOS4.2 | MOS4.1 MOS4.6 MOS4.5
N$7  (via drill 0.35)
  Top 0.406: v33.71,95.56 35.08,94.19 CN1.CLK 35.41,93.99 R11.2 37.27,92.26
  Bottom 0.406: R9.1 33.58,95.61 33.58,95.56 v33.71,95.56
N$8
  Top 0.406: MOS2.5 MOS2.6 MOS2.1 MOS2.2 79.66,36.72 79.06,36.72 77.96,35.62 DCDC2.VIN
N$9
  Top 0.406: MOS9.4 89.57,24.42 D3.C R18.2 81.68,23.6 MOS10.4
N$10
  Top 0.406: MOS9.5 MOS9.6 | MOS9.6 MOS9.1 MOS9.2 | MOS9.6 MOS8.1 | MOS8.1 MOS8.6 MOS8.5 | MOS8.1 MOS8.2
N$11
  Top 0.406: R27.2 84.03,106.54 PWR2.CT
N$12
  Top 0.406: MOS7.1 MOS7.6 MOS7.5 | MOS7.2 MOS7.1 | MOS7.1 MOS3.6 | MOS3.6 MOS3.1 MOS3.2 | MOS3.6 MOS3.5
N$13
  Top 0.406: DCDC3.VIN 76.38,25.46 MOS10.2 MOS10.1 MOS10.6 MOS10.5
N$14
  Top 0.406: MOS5.1 MOS5.6 MOS5.5 MOS5.2 MOS5.1 | MOS5.1 90.56,57.71 R13.1 R14.2
N$15
  Top 0.406: PWR1.CT 23.16,21.05 R21.2
N$16
  Top 0.406: R22.2 LED2.CT
N$17
  Top 0.406: R23.2 13.82,27.6 LED3.CT
N$18
  Top 0.406: R24.2 11,30.17 LED4.CT
N$19
  Top 0.406: R28.2 92.19,102.22 LED5.CT
N$20
  Top 0.406: R29.2 87.92,104.38 LED6.CT
N$22
  Bottom 0.406: R41.1 17.96,65.12 17.96,68.38 | 17.96,68.38 17.96,74.48 18.05,74.57 R40.1 | C22.1 19.19,68.38 17.96,68.38
NRST0  (via drill 0.35)
  Top 0.406: RST.P$1 40.1,109.17 C5.1 43.61,103.22 R2.1 43.65,94.54 v45.39,94.54 | STM0.NRST 46.37,88.03 47.17,88.83 v47.3,88.96
  Bottom 0.406: v47.3,88.96 47.3,92.64 v45.39,94.54
NRST1
  Top 0.406: STM1.NRST 45.65,30.19 R20.1 45.65,19.14 C14.1 40.91,10.07 RST1.P$1
NRST2  (via drill 0.35)
  Top 0.406: U$1.NRST 80.52,82.48 83.86,79.14 85.94,79.14 89.36,82.57 R26.1 91.58,85.19 v91.62,85.15 | v78.54,103.05 78.54,105.68 C19.1 79.16,106.3 RST2.P$1
  Bottom 0.406: v91.62,85.15 91.62,89.97 v78.54,103.05
NSS  (via drill 0.35)
  Top 0.406: v30.79,92.64 31.27,92.16 31.69,92.16 32.19,91.66 CN1.CD/DAT3 32.74,91.58 v34.35,89.97 | STM0.PA4/SPI1_NSS 40.34,90.61 40.31,90.61 v40.19,90.73
  Bottom 0.406: v30.79,92.64 29.9,92.64 R7.1 | v34.35,89.97 34.79,90.42 35.87,89.34 38.16,89.34 39.87,91.05 v40.19,90.73
PWM
  Top 0.406: U$1.PA5/SPI1_SCK 90.55,97.06 SV.P$1
RXCAN  (via drill 0.35)
  Top 0.406: STM0.PA12/CAN_TX 39.61,80.42 39.38,80.42 38.95,79.99 38.95,79.38 39.55,78.77 v39.55,78.16
  Bottom 0.406: v39.55,78.16 36.25,74.86 35.73,74.86 35.59,74.72 32.96,74.72 31.43,73.19 31.43,72.14 31.23,71.93 30.48,71.93 29.38,70.84 29.38,67.45 29.39,67.44 29.39,65.97 30.03,65.33 U$3.4
RXCAN1  (via drill 0.35)
  Top 0.406: STM1.PA12/CAN_TX 34.26,40.44 34.25,40.43 v34.21,40.43
  Bottom 0.406: v34.21,40.43 28.84,45.8 28.71,45.8 15.8,58.71 U$5.4
RXCAN2  (via drill 0.35)
  Top 0.406: v83.62,70.8 81.46,72.95 v81.46,76.51 | v75.11,86.67 74.86,86.92 74.86,87.25 U$1.PA12/CAN_TX
  Bottom 0.406: v83.62,70.8 90.61,63.81 U$6.4 | v81.46,76.51 75.11,82.86 v75.11,86.67
SCK
  Top 0.406: STM0.PA5/SPI1_SCK 40.59,89.16 38.69,91.06 R11.1
SCL0  (via drill 0.35)
  Top 0.406: BMP1.P3 48.32,64.08 R33.2 | v43.62,78.16 43.62,80.11 STM0.PA15/I2C1_SCL
  Bottom 0.406: BMX1.SCL 54.94,57.45 BMP1.P3 43.62,68.78 v43.62,78.16
SCL1  (via drill 0.35)
  Top 0.406: BMP3.P3 47.49,55.07 R35.2 | STM1.PA15/I2C1_SCL 38.4,35.87 v39.3,35.87
  Bottom 0.406: v39.3,35.87 40.95,35.87 43.28,38.2 43.94,38.2 47.49,41.75 BMP3.P3
SCL2  (via drill 0.35)
  Top 0.406: R31.2 71.81,63.95 BMP2.P3 55.76,46 55.44,46 55.23,45.79 55.23,41.16 56.49,39.9 BMX2.SCL | U$1.PA15/I2C1_SCL 69.78,81.95 v69.78,81.84
  Bottom 0.406: v69.78,81.84 69.78,65.99 BMP2.P3
SDA0  (via drill 0.35)
  Top 0.406: R32.1 52.19,66.07 BMP1.P4 | STM0.PB7/I2C1_SDA 47.17,82.64 v47.17,81.34
  Bottom 0.406: BMX1.SDA 54.95,59.98 BMP1.P4 47.17,67.76 v47.17,81.34
SDA1  (via drill 0.35)
  Top 0.406: BMP3.P4 44.95,53.8 R34.1 | STM1.PB7/I2C1_SDA 40.57,32.38 v40.57,34.6
  Bottom 0.406: v40.57,34.6 43.61,37.64 50.52,37.64 53.48,40.61 53.48,42.94 48.75,47.68 48.75,57.77 48.01,58.51 46.97,58.51 45.71,57.25 BMP3.P4
SDA2  (via drill 0.35)
  Top 0.406: R30.1 75.62,63.32 BMP2.P4 75.3,61.02 BMX2.SDA | U$1.PB7/I2C1_SDA 75.92,82.16 76.31,82.55 76.6,82.55 77.78,81.37 77.78,78.85 75.06,76.13 75.06,75.37 v72.45,75.37
  Bottom 0.406: v72.45,75.37 72.9,74.91 72.9,69.67 75.3,67.27 BMP2.P4
SW  (via drill 0.35)
  Top 0.406: MOS1.3 80.11,47.73 R16.1 80.11,41.16 80.19,41.08 80.07,40.95 v80.07,40.44 99.35,40.44 104.7,45.79 106.77,45.79 110.35,49.37 SW1.L | MOS10.3 v80.09,22.43 80.09,19.98 R18.1 | v80.07,28.89 80.07,31.77 R15.1 80.07,31.84 v80.07,34.09 80.07,35.96 MOS2.3
  Bottom 0.406: v80.07,34.09 v80.07,40.44 | v80.09,22.43 80.09,28.86 v80.07,28.89
SWCLK  (via drill 0.35)
  Top 0.406: STM0.PA14/SWCLK 40.57,79.11 v40.57,78.8
  Bottom 0.406: JP1.3 50.86,108.51 50.86,87.81 41.84,78.8 v40.57,78.8
SWCLK1  (via drill 0.35)
  Top 0.406: STM1.PA14/SWCLK 35.12,35.98 v34.73,36.38
  Bottom 0.406: JP3.3 47.17,9.84 47.17,16.01 47.08,16.1 47.08,24.02 v34.73,36.38
SWCLK2
  Top 0.406: U$1.PA14/SWCLK 72.81,87.31 72.42,87.7 72.42,111.08 JP4.3
SWDIO  (via drill 0.35)
  Top 0.406: STM0.PA13/SWDIO 40.01,79.69 v39.68,79.69
  Bottom 0.406: v39.68,79.69 41.46,79.69 50.09,88.32 50.09,106.74 JP1.1
SWDIO1  (via drill 0.35)
  Top 0.406: STM1.PA13/SWDIO 35.79,37.77 v35.74,37.77
  Bottom 0.406: v35.74,37.77 48.4,25.11 48.4,19.5 47.84,18.94 47.84,11.7 JP3.1
SWDIO2
  Top 0.406: JP4.5 73.97,94.95 72.99,93.97 72.99,88.27 73.38,87.88 U$1.PA13/SWDIO
SWO  (via drill 0.35)
  Top 0.406: STM0.PB3/SWO 45.9,79.39 v45.9,79.18
  Bottom 0.406: v45.9,79.18 45.9,81.82 51.67,87.58 51.67,110.24 JP1.5
SWO1  (via drill 0.35)
  Top 0.406: STM1.PB3/SWO 37.02,33.34 v35.23,31.55
  Bottom 0.406: v35.23,31.55 45.9,20.88 JP3.5
SWO2
  Top 0.406: JP4.1 71.43,109.53 71.43,85.91 72.88,85.91 72.91,85.94 73.21,85.94 73.24,85.91 74.61,85.91 74.61,85.64 U$1.PB3/SWO
TXCAN  (via drill 0.35)
  Top 0.406: STM0.PA11/CAN_RX 37.9,79.84 37.9,79.69 v37.91,79.67
  Bottom 0.406: v37.91,79.67 34.77,76.53 32.59,76.53 32.39,76.32 32.39,74.93 U$3.1
TXCAN1  (via drill 0.35)
  Top 0.406: STM1.PA11/CAN_RX 34.85,40.98 v34.85,41.08
  Bottom 0.406: v34.85,41.08 29.75,46.19 29.75,46.84 17.2,59.39 17.2,72.19 16.31,73.08 U$5.1
TXCAN2  (via drill 0.35)
  Top 0.406: v85.53,71.43 83.37,73.59 v83.37,76.51 | U$1.PA11/CAN_RX 76.06,87.18 v76.13,87.18
  Bottom 0.406: v76.13,87.18 76.13,83.75 v83.37,76.51 | v85.53,71.43 U$6.1

### Text on the board
tPlace: controller | logger | Downlink | PWR | DownLink